# Altium project STM32.PrjPcb
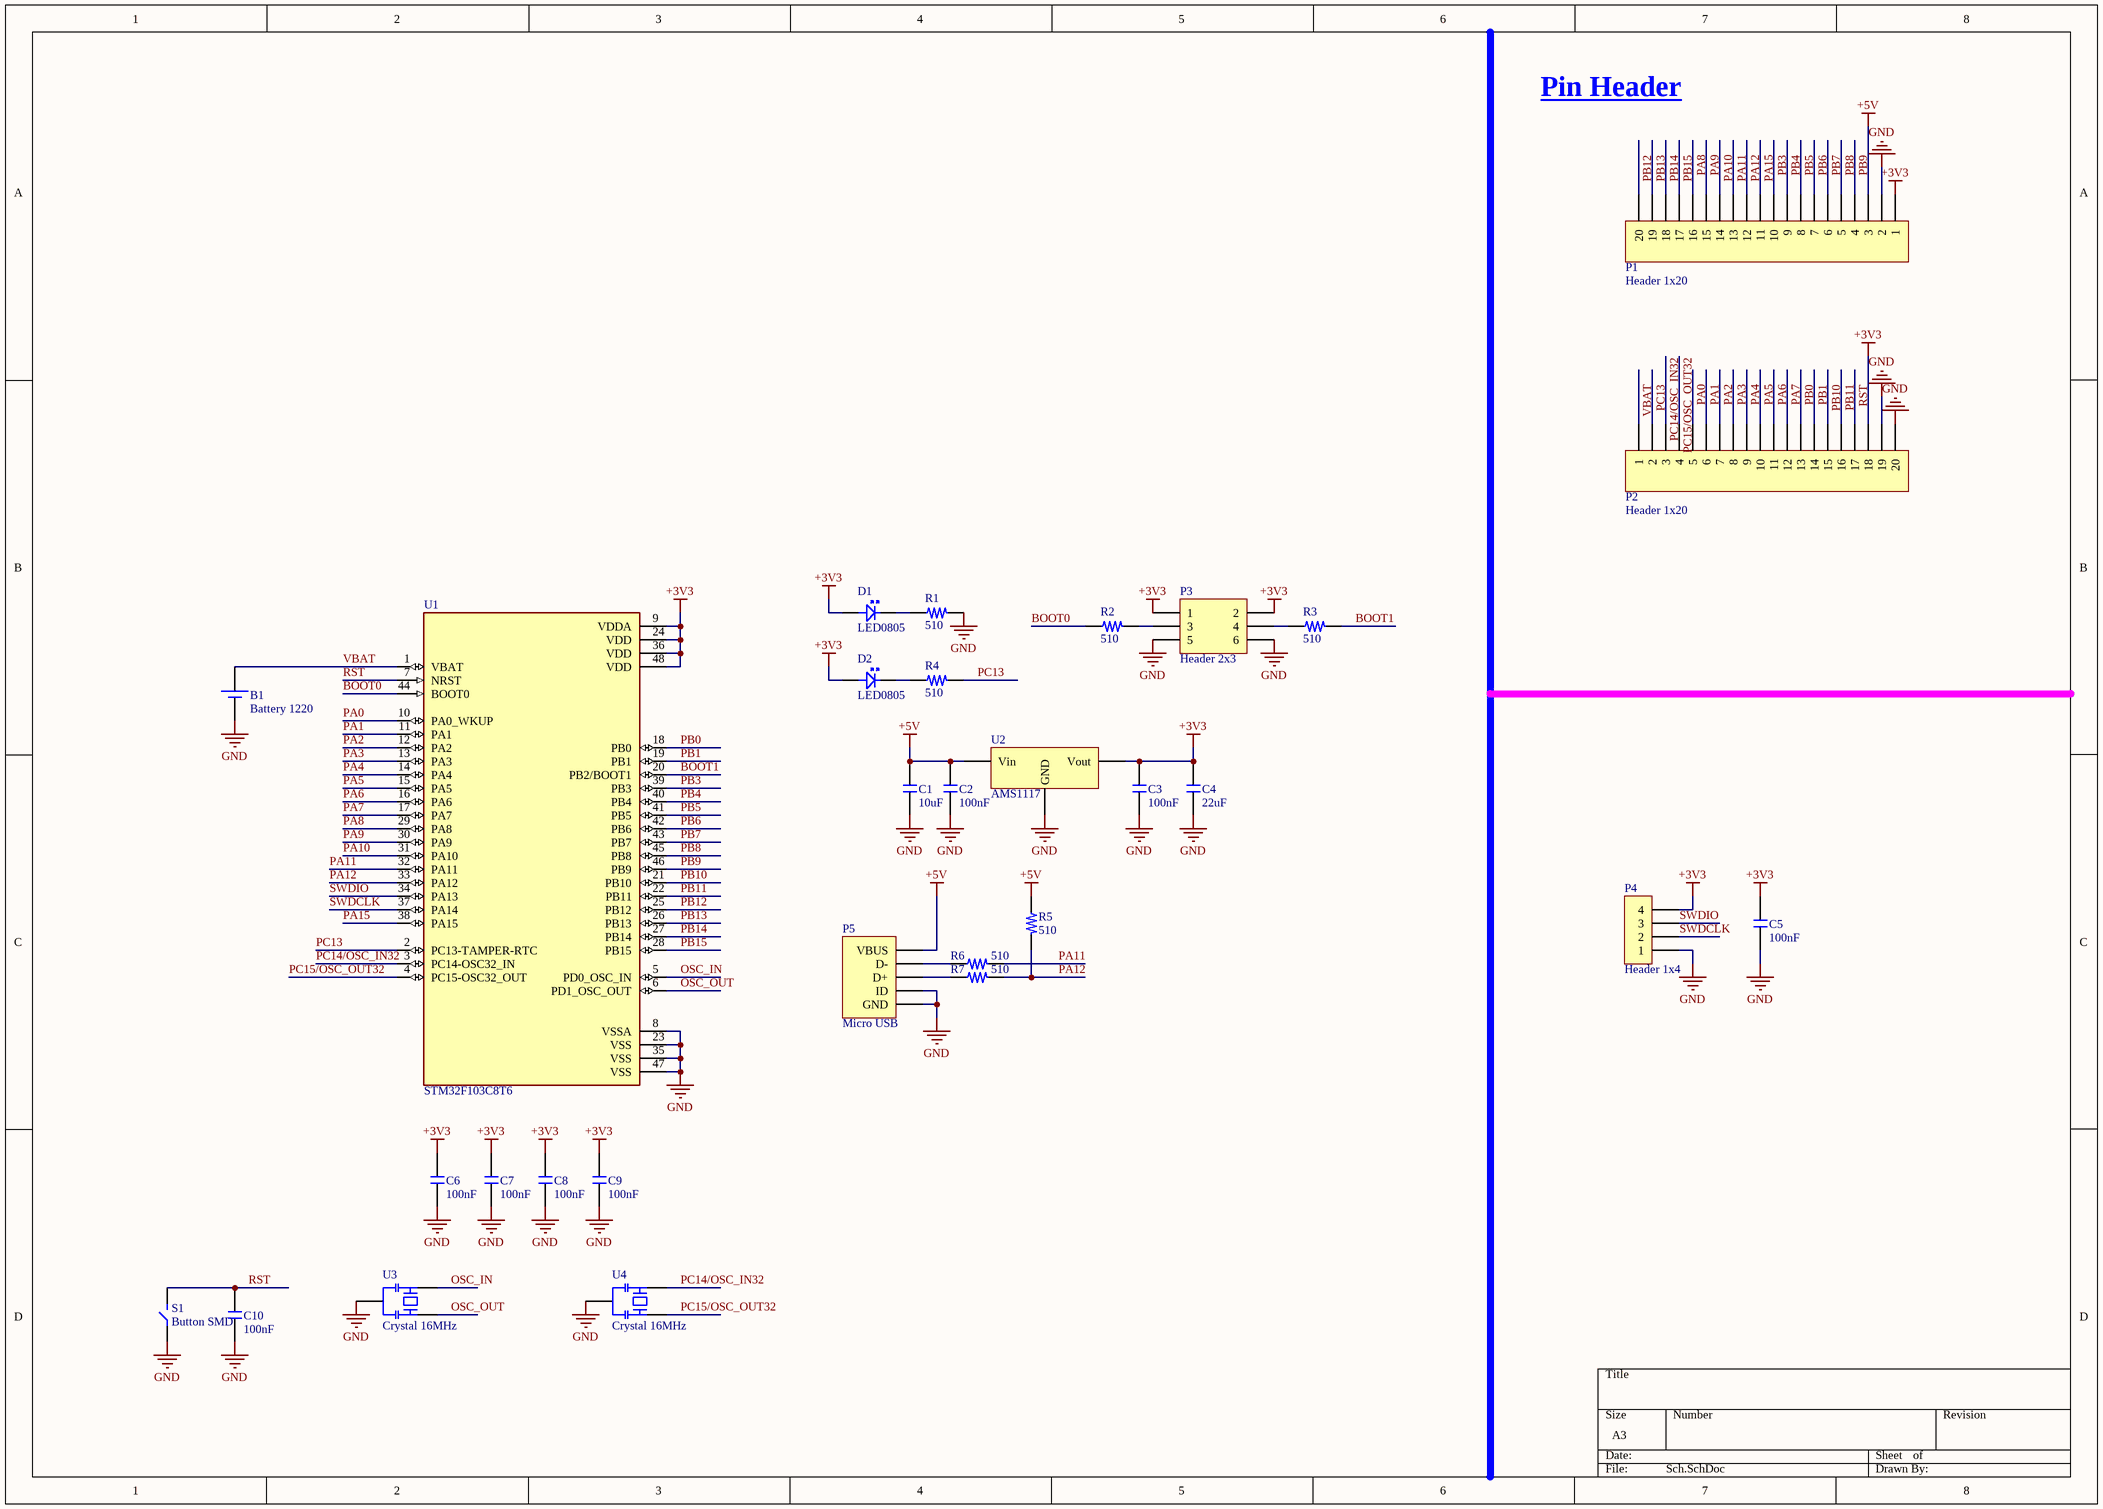
[diagram p0: Sch.SchDoc]
1 sheet, 30 parts. Net scope: global (net labels, ports and power ports of the same name join across sheets).
Board file: PCB.PcbDoc

## Sheet Sch.SchDoc
size A3; SheetNumber: 1; SheetTotal: 1

### Parts
B1  Battery 1220  [Battery 1220]
C1  10uF  [C805]
C2  100nF  [C805]
C3  100nF  [C805]
C4  22uF  [C805]
C5  100nF  [C805]
C6  100nF  [C805]
C7  100nF  [C805]
C8  100nF  [C805]
C9  100nF  [C805]
C10  100nF  [C805]
D1  LED0805  [LED0805]
D2  LED0805  [LED0805]
P1  Header 1x20  [Header 1x20]
P2  Header 1x20  [Header 1x20]
P3  Header 2x3  [Header 2x3]
P4  Header 1x4  [Header 1x4]
P5  Micro USB  [Micro USB]
R1  510  [R805]
R2  510  [R805]
R3  510  [R805]
R4  510  [R805]
R5  510  [R805]
R6  510  [R805]
R7  510  [R805]
S1  Button SMD  [Button SMD]
U1  STM32F103C8T6  [QFP50P900X900X160-48N]
U2  AMS1117  [SOT223]
U3  Crystal 16MHz  [Crystal 16MHz]
U4  Crystal 16MHz  [Crystal 16MHz]

### Nets
+3V3: C3.2 C4.2 C5.2 C6.2 C7.2 C8.2 C9.2 D1.1 D2.1 P1.1 P2.18 P3.1 P3.2 P4.4 U1.9(VDDA) U1.24(VDD) U1.36(VDD) U1.48(VDD) U2.2(Vout)
+5V: C1.2 C2.2 P1.3 P5.1(VBUS) R5.1 U2.3(Vin)
GND: B1.1 C1.1 C2.1 C3.1 C4.1 C5.1 C6.1 C7.1 C8.1 C9.1 C10.1 P1.2 P2.19 P2.20 P3.5 P3.6 P4.1 P5.4(ID) P5.5(GND) R1.2 S1.1 U1.8(VSSA) U1.23(VSS) U1.35(VSS) U1.47(VSS) U2.1(GND) U3.2 U4.2
BOOT0: R2.1 U1.44(BOOT0)
BOOT1: R3.2 U1.20(PB2/BOOT1)
OSC_IN: U1.5(PD0_OSC_IN) U3.1
OSC_OUT: U1.6(PD1_OSC_OUT) U3.3
PA0: P2.5 U1.10(PA0_WKUP)
PA1: P2.6 U1.11(PA1)
PA2: P2.7 U1.12(PA2)
PA3: P2.8 U1.13(PA3)
PA4: P2.9 U1.14(PA4)
PA5: P2.10 U1.15(PA5)
PA6: P2.11 U1.16(PA6)
PA7: P2.12 U1.17(PA7)
PA8: P1.16 U1.29(PA8)
PA9: P1.15 U1.30(PA9)
PA10: P1.14 U1.31(PA10)
PA11: P1.13 R6.2 U1.32(PA11)
PA12: P1.12 R5.2 R7.2 U1.33(PA12)
PA15: P1.11 U1.38(PA15)
PB0: P2.13 U1.18(PB0)
PB1: P2.14 U1.19(PB1)
PB3: P1.10 U1.39(PB3)
PB4: P1.9 U1.40(PB4)
PB5: P1.8 U1.41(PB5)
PB6: P1.7 U1.42(PB6)
PB7: P1.6 U1.43(PB7)
PB8: P1.5 U1.45(PB8)
PB9: P1.4 U1.46(PB9)
PB10: P2.15 U1.21(PB10)
PB11: P2.16 U1.22(PB11)
PB12: P1.20 U1.25(PB12)
PB13: P1.19 U1.26(PB13)
PB14: P1.18 U1.27(PB14)
PB15: P1.17 U1.28(PB15)
PC13: P2.2 R4.2 U1.2(PC13-TAMPER-RTC)
PC14/OSC_IN32: P2.3 U1.3(PC14-OSC32_IN) U4.1
PC15/OSC_OUT32: P2.4 U1.4(PC15-OSC32_OUT) U4.3
RST: C10.2 P2.17 S1.2 U1.7(NRST)
SWDCLK: P4.2 U1.37(PA14)
SWDIO: P4.3 U1.34(PA13)
VBAT: B1.2 P2.1 U1.1(VBAT)
NetD1_2: D1.2 R1.1
NetD2_2: D2.2 R4.1
NetP3_3: P3.3 R2.2
NetP3_4: P3.4 R3.1
NetP5_2: P5.2(D-) R6.1
NetP5_3: P5.3(D+) R7.1

### Notes on the sheet
- Pin Header

### Library data of the parts
C1-C10 = C0805
R1-R7 = R0805
U1 = STM32F103C8T6: ARMÂ® CortexÂ®-M3 STM32F1 Microcontroller IC 32-Bit 72MHz 64KB _64K x 8_ FLASH; MF: STMicroelectronics; Price: None; Package: LQFP-48 STMicroelectronics; Value: *; MP: STM32F103C8T6; Availability: Unavailable; SnapEDA_Link: https://www.snapeda.com/parts/STM32F103C8T6/STMicroelectronics/view-part/52195/?ref=snap